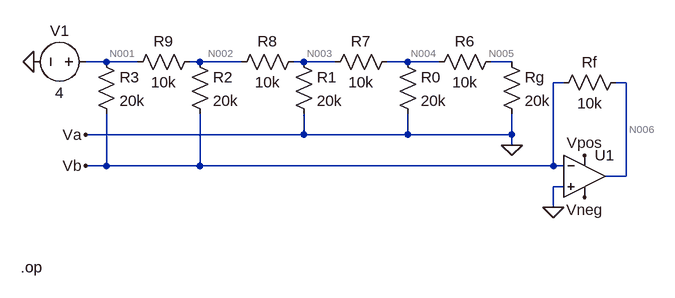
[diagram p0: schematic hw6q3.asc]
hw6q3.asc, the LTspice schematic file:
Version 4
SHEET 1 880 680
WIRE -464 0 -496 0
WIRE -416 0 -464 0
WIRE -320 0 -336 0
WIRE -256 0 -320 0
WIRE -160 0 -176 0
WIRE -112 0 -160 0
WIRE 0 0 -32 0
WIRE 48 0 0 0
WIRE 160 0 128 0
WIRE 240 32 224 32
WIRE 336 32 320 32
WIRE -160 112 -160 80
WIRE -160 112 -496 112
WIRE 0 112 0 80
WIRE 0 112 -160 112
WIRE 160 112 160 80
WIRE 160 112 0 112
WIRE 160 128 160 112
WIRE -464 160 -464 80
WIRE -464 160 -496 160
WIRE -320 160 -320 80
WIRE -320 160 -464 160
WIRE 224 160 224 32
WIRE 224 160 -320 160
WIRE 240 160 224 160
WIRE 336 176 336 32
WIRE 336 176 304 176
WIRE 240 192 224 192
WIRE 224 224 224 192
FLAG 272 144 Vpos
FLAG 272 208 Vneg
FLAG 224 224 0
FLAG 160 128 0
FLAG -496 112 Va
FLAG -496 160 Vb
FLAG -576 0 0
SYMBOL Opamps\\UniversalOpamp2 272 176 R0
SYMATTR InstName U1
SYMBOL res 336 16 R90
WINDOW 0 0 56 VBottom 2
WINDOW 3 32 56 VTop 2
SYMATTR InstName Rf
SYMATTR Value 10k
SYMBOL res -336 -16 R0
SYMATTR InstName R2
SYMATTR Value 20k
SYMBOL res -176 -16 R0
SYMATTR InstName R1
SYMATTR Value 20k
SYMBOL res -16 -16 R0
SYMATTR InstName R0
SYMATTR Value 20k
SYMBOL res 144 -16 R0
SYMATTR InstName Rg
SYMATTR Value 20k
SYMBOL res 144 -16 R90
WINDOW 0 0 56 VBottom 2
WINDOW 3 32 56 VTop 2
SYMATTR InstName R6
SYMATTR Value 10k
SYMBOL res -16 -16 R90
WINDOW 0 0 56 VBottom 2
WINDOW 3 32 56 VTop 2
SYMATTR InstName R7
SYMATTR Value 10k
SYMBOL res -160 -16 R90
WINDOW 0 0 56 VBottom 2
WINDOW 3 32 56 VTop 2
SYMATTR InstName R8
SYMATTR Value 10k
SYMBOL res -320 -16 R90
WINDOW 0 0 56 VBottom 2
WINDOW 3 32 56 VTop 2
SYMATTR InstName R9
SYMATTR Value 10k
SYMBOL res -480 -16 R0
SYMATTR InstName R3
SYMATTR Value 20k
SYMBOL voltage -480 0 R90
WINDOW 0 -32 56 VBottom 2
WINDOW 3 32 56 VTop 2
WINDOW 123 0 0 Left 2
WINDOW 39 0 0 Left 2
SYMATTR InstName V1
SYMATTR Value 4
TEXT -596 316 Left 2 !.op

The netlist it stands for:
* hw6q3.asc
XU1 0 Vb Vpos Vneg N006 level.2 Avol=1Meg GBW=10Meg Slew=10Meg ilimit=25m rail=0 Vos=0 phimargin=45 en=0 enk=0 in=0 ink=0 Rin=500Meg  ; pins IN+ IN- V+ V- OUT
Rf N006 Vb 10k
R2 N002 Vb 20k
R1 N003 0 20k
R0 N004 0 20k
Rg N005 0 20k
R6 N005 N004 10k
R7 N004 N003 10k
R8 N003 N002 10k
R9 N002 N001 10k
R3 N001 Vb 20k
V1 N001 0 4
.op
.lib UniversalOpamps2.sub
.backanno
.end

* Results of the author's LTspice run, read from the files saved beside the schematic
* Operating Point:
*   V(n006) = 3.437 V
*   V(vpos) = 3.192 V
*   V(vneg) = 3.437 V
*   V(vb) = 3.437 V
*   V(n002) = 2.876 V
*   V(n003) = 1.471 V
*   V(n004) = 802.6 mV
*   V(n005) = 535.1 mV
*   V(n001) = 4 V
*   I(R3) = 28.13 µA
*   I(R9) = -112.4 µA
*   I(R8) = -140.5 µA
*   I(R7) = -66.89 µA
*   I(R6) = -26.75 µA
*   I(Rg) = 26.75 µA
*   I(R0) = 40.13 µA
*   I(R1) = 73.57 µA
*   I(R2) = -28.07 µA
*   I(Rf) = -55.16 nA
*   I(V1) = -140.5 µA
*   Ix(u1:1) = -6.629 nA
*   Ix(u1:2) = 245.8 pA
*   Ix(u1:3) = 0 A
*   Ix(u1:4) = 0 A
*   Ix(u1:5) = 55.16 nA